# EasyEDA schematic SCH_orange_pi_zero_2022-04-15.json
TITLE: Sheet_1; REV: 1.0; Date: 2022-03-22; Sheet: 1/1; Company: Your Company
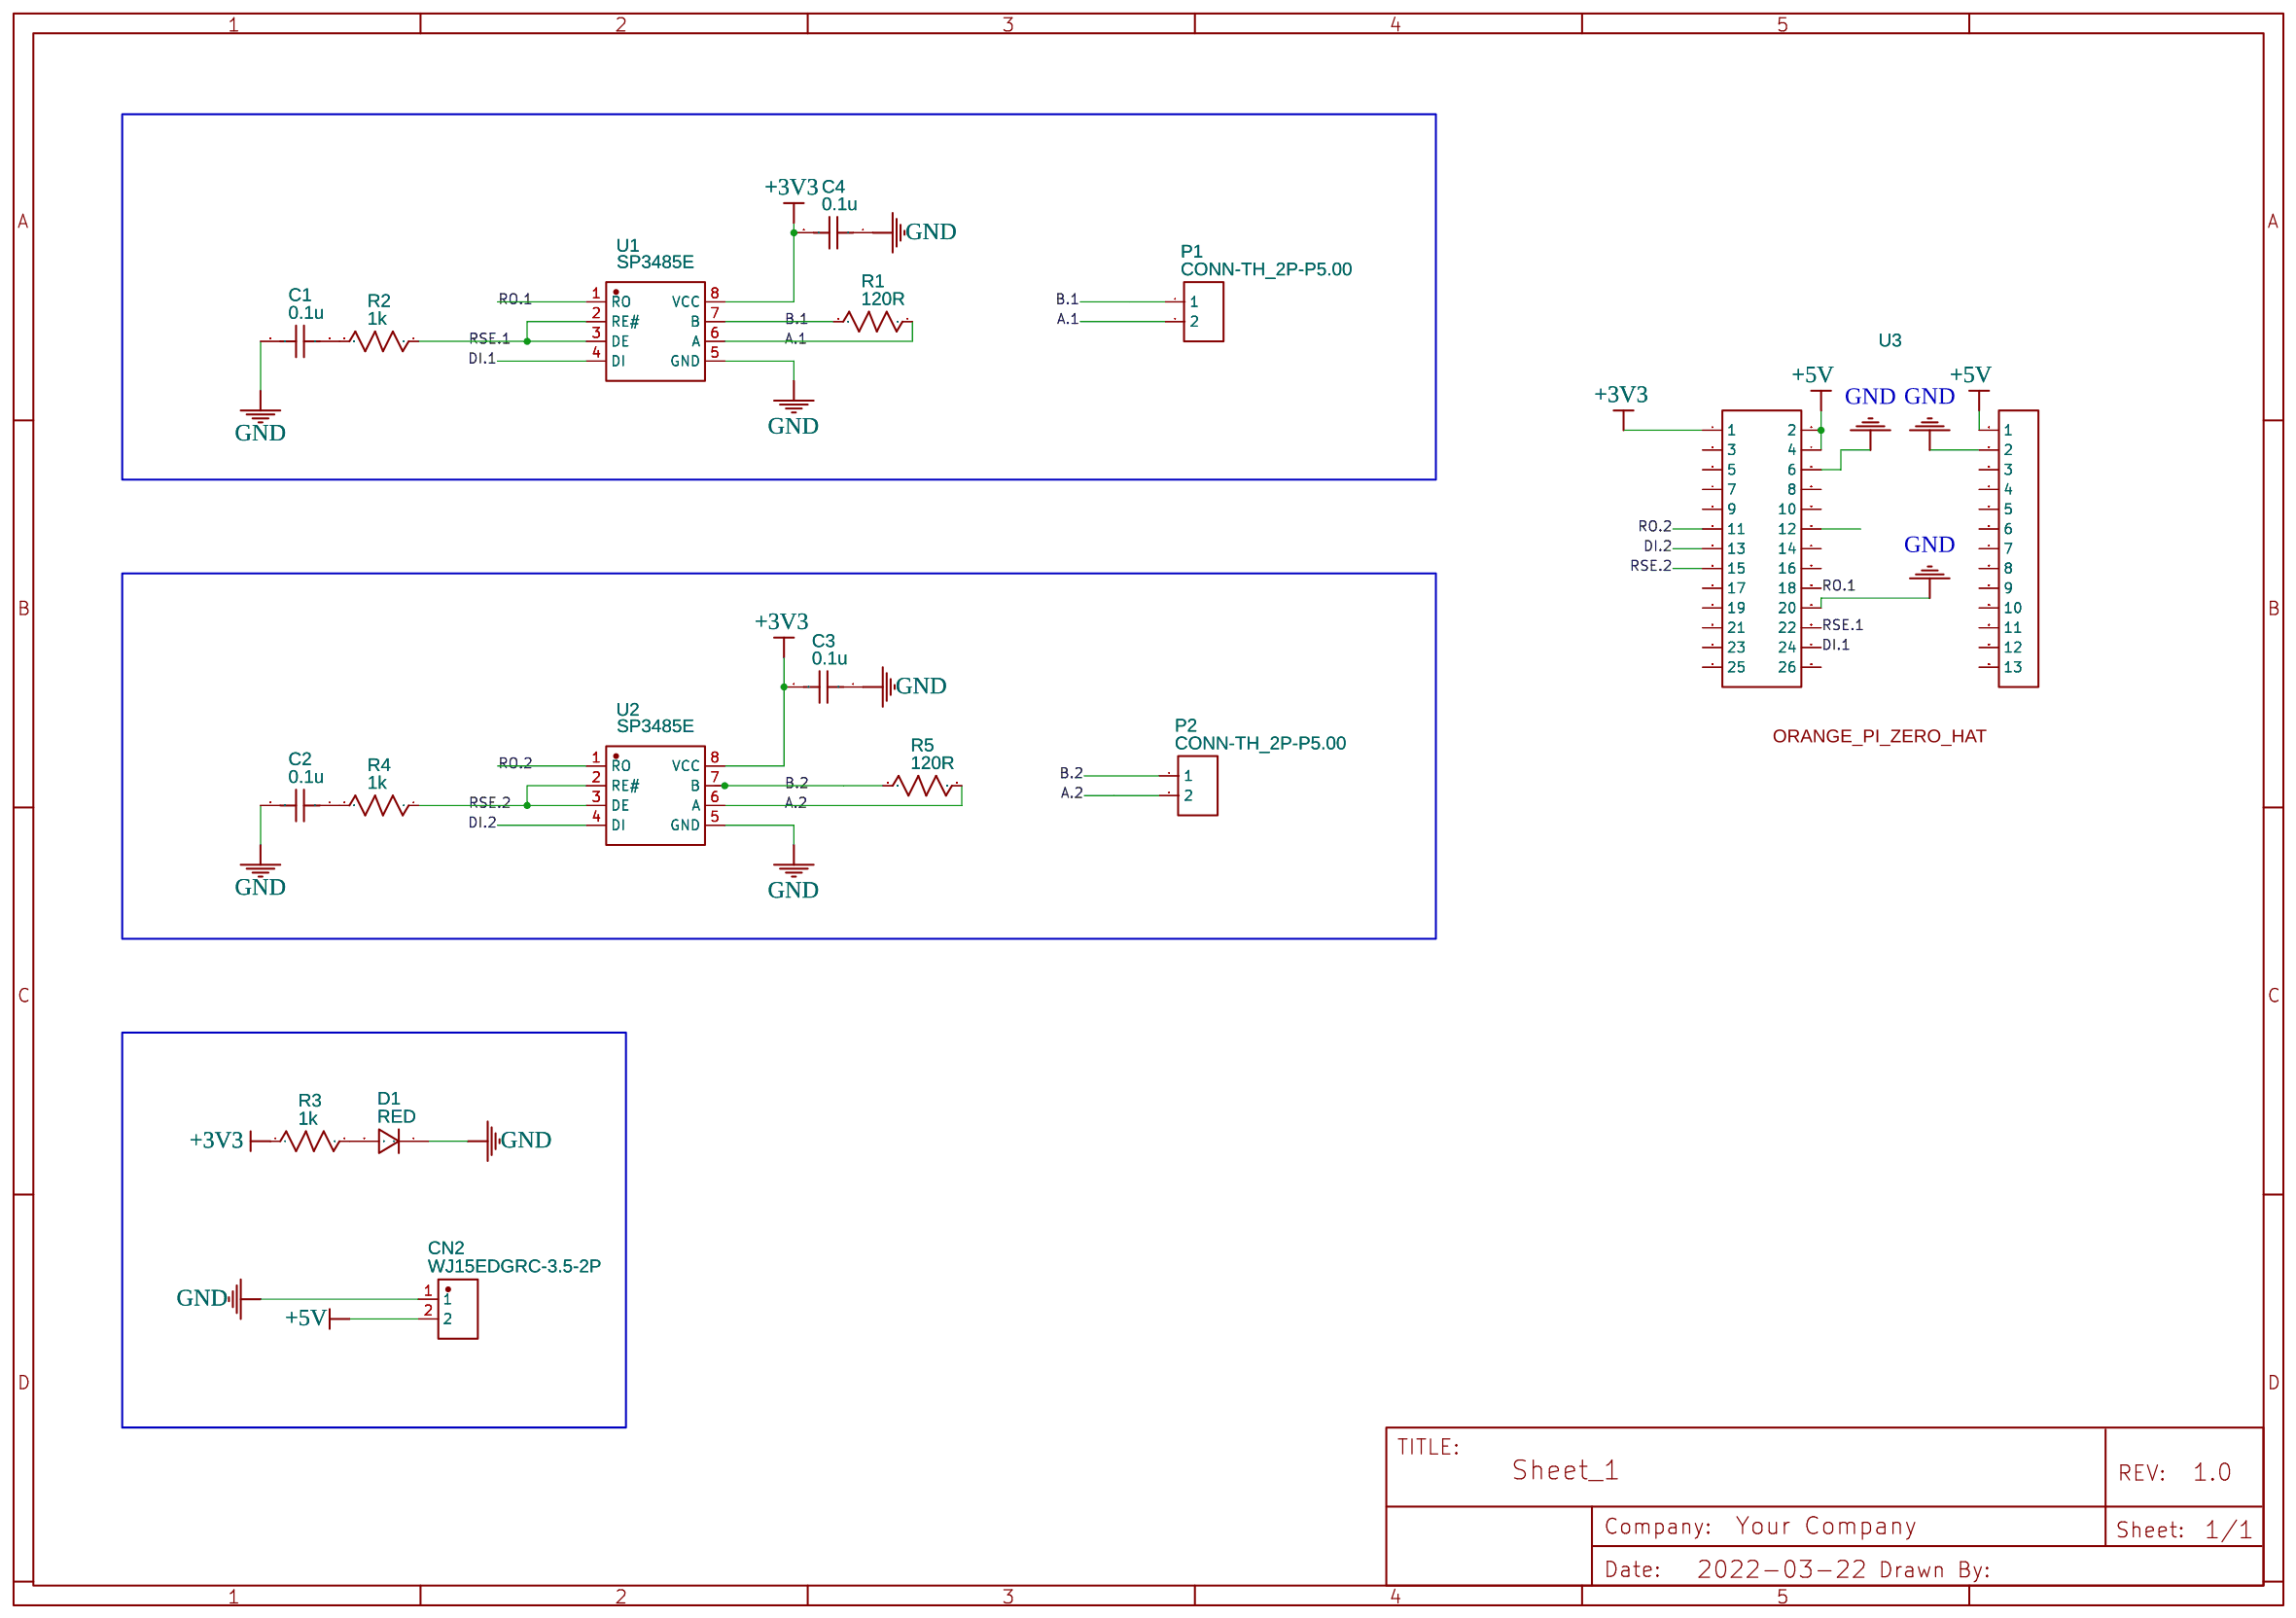
[diagram p0: schematic sheet]

## Parts
C1  0.1u  [C0603]
C2  0.1u  [C0603]
C3  0.1u  [C0603]
C4  0.1u  [C0603]
CN2  WJ15EDGRC-3.5-2P  [CONN-TH_2P-P3.50_WJ15EDGRC-3.5-2P]
D1  RED  [SOD-123_L2.8-W1.8-LS3.7-RD]
P1  CONN-TH_2P-P5.00  [CONN-TH_2P-P5.00]
P2  CONN-TH_2P-P5.00  [CONN-TH_2P-P5.00]
R1  120R  [R0603]
R2  1k  [R0603]
R3  1k  [R0603]
R4  1k  [R0603]
R5  120R  [R0603]
U1  SP3485E  [SOIC-8_L5.0-W4.0-P1.27-LS6.0-BL]
U2  SP3485E  [SOIC-8_L5.0-W4.0-P1.27-LS6.0-BL]
U3  HDR-F-2.54_2x13  [ORANGE_PI_ZERO_HAT]

## Library data of the parts
C1-C4 = C_0603_US: Contributor: LCEDA_Lib
CN2 = WJ15EDGRC-3.5-2P: Supplier: LCSC; Supplier Part: C2924837; Manufacturer: KANGNEX(康奈克斯电气); Contributor: LCSC; Package Display: No
D1 = 1N4007W: Supplier: LCSC; Supplier Part: C328592; Manufacturer: BLUE ROCKET; Contributor: LCEDA_Lib
P1 P2 = CONN-TH_2P-P5.00: Supplier: LCSC; Contributor: LCEDA_Lib
R1-R5 = R_0603_US: Contributor: LCEDA_Lib
U1 U2 = SP3485EN-L/TR: Supplier: LCSC; Manufacturer: EXAR; Supplier Part: C8963; JLCPCB Part Class: Basic Part
U3 = HDR-F-2.54_2x13: Contributor: imp.cepera; Package Display: Yes

## Nets
+3V3: C3.2 C4.2 R3.1 U1.8(VCC) U2.8(VCC) U3.1
+5V: CN2.2 U3.2 U3.4 U3.e1(1)
GND: C1.2 C2.2 C3.1 C4.1 CN2.1 D1.1 U1.5(GND) U2.5(GND) U3.6 U3.20 U3.e2(2)
A.1: P1.2 R1.1 U1.6(A)
A.2: P2.2 R5.1 U2.6(A)
B.1: P1.1 R1.2 U1.7(B)
B.2: P2.1 R5.2 U2.7(B)
DI.1: U1.4(DI) U3.24
DI.2: U2.4(DI) U3.13
RO.1: U1.1(RO) U3.18
RO.2: U2.1(RO) U3.11
RSE.1: R2.1 U1.2(RE#) U1.3(DE) U3.22
RSE.2: R4.1 U2.2(RE#) U2.3(DE) U3.15
Net-(C1-1): C1.1 R2.2
Net-(C2-1): C2.1 R4.2
Net-(D1-2): D1.2 R3.2

Not connected (* = marked no-connect by the designer): U3 3 5 7 8 9 10 12 14 16 17 19 21 23 25 26 e3(3) e4(4) e5(5) e6(6) e7(7) e8(8) e9(9) e10(10) e11(11) e12(12) e13(13)
